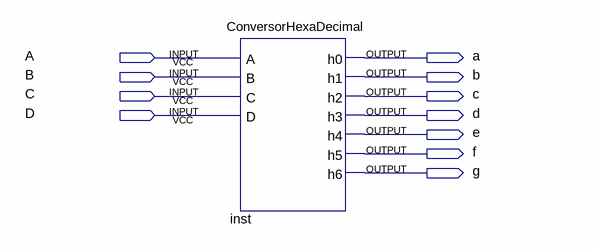
[diagram p0: schematic sheet]
// Quartus schematic TesteConversor.bdf as structural Verilog: 1 symbols, 11 pins
module TesteConversor (
  inout  A,
  inout  B,
  inout  C,
  inout  D,
  output e,
  output f,
  output g
);

  ConversorHexaDecimal inst (.A(A), .B(B), .C(C), .D(D), .h0(A), .h1(B), .h2(C), .h3(D), .h4(e), .h5(f), .h6(g));
endmodule
